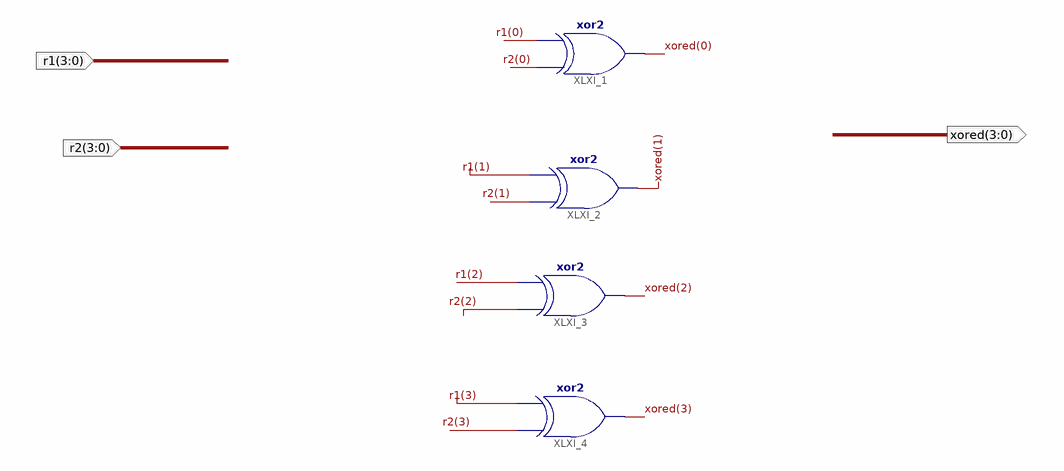
[diagram p0: schematic sheet 1]
// Xilinx ISE schematic xor1.sch (artix7) as structural Verilog: 4 symbols, 3 ports
module xor1 (
  input  [3:0] r1,
  input  [3:0] r2,
  output [3:0] xored
);

  xor XLXI_1 (xored[0], r2[0], r1[0]);
  xor XLXI_2 (xored[1], r2[1], r1[1]);
  xor XLXI_3 (xored[2], r2[2], r1[2]);
  xor XLXI_4 (xored[3], r2[3], r1[3]);
endmodule
